# Altium schematic sheet COMPONENT BLOCKS 1.SchDoc
size A4; SheetNumber: 3; SheetTotal: 5
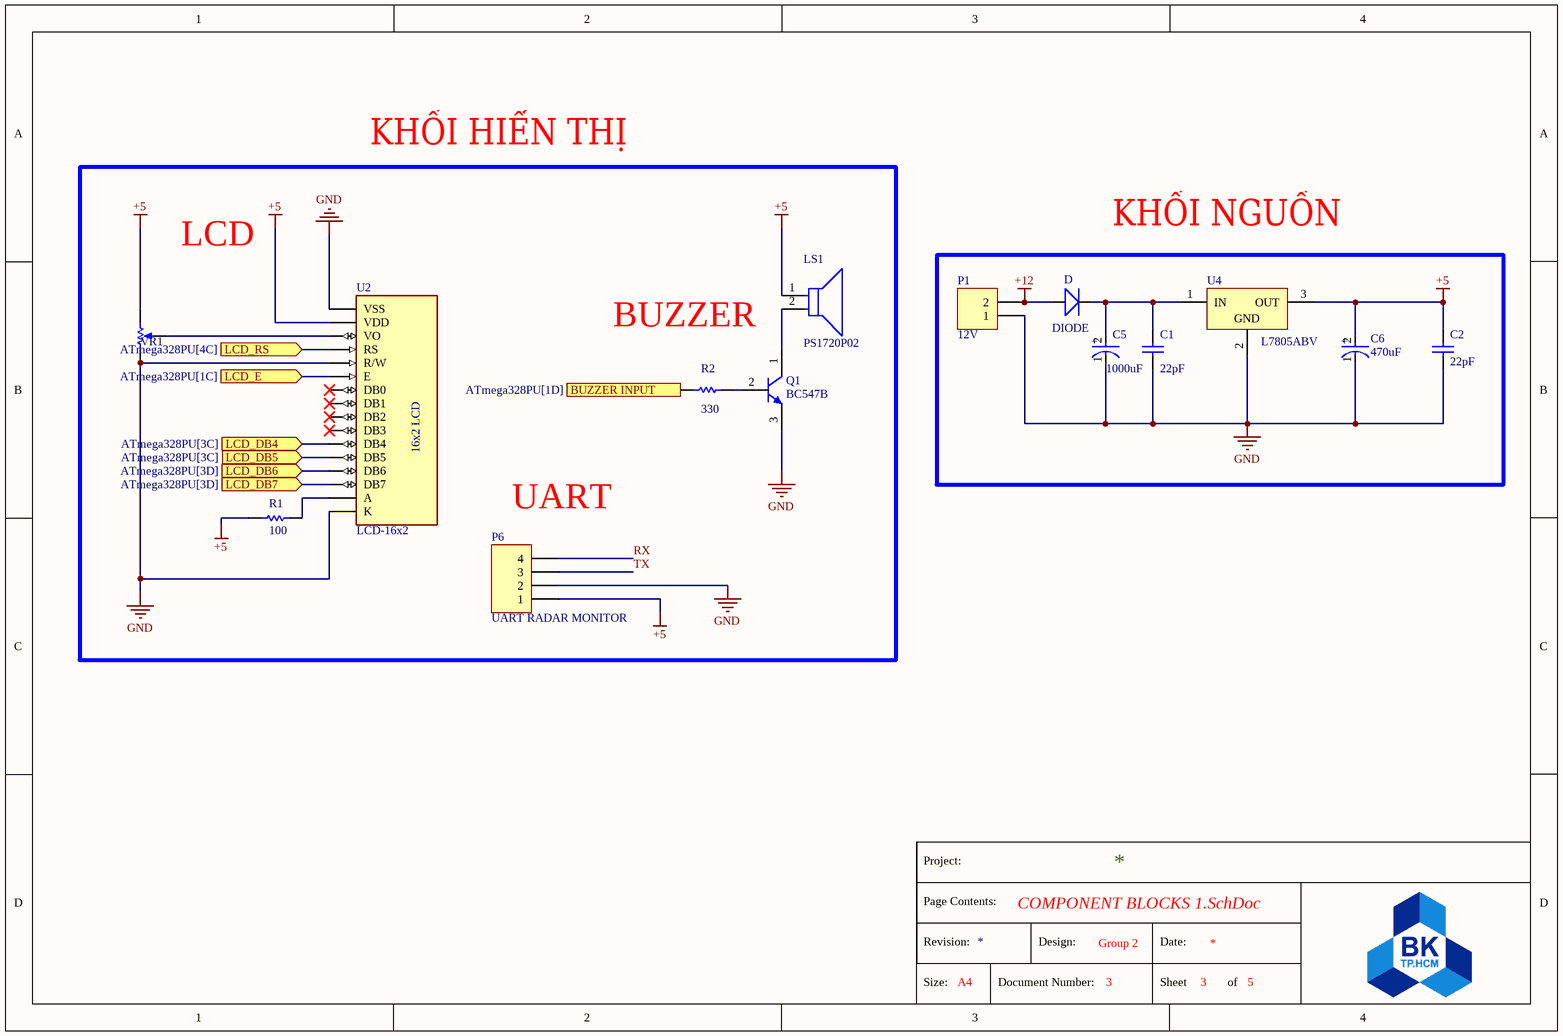
[diagram p0: COMPONENT BLOCKS 1.SchDoc]

## Parts
C1  value 22pF  [RAD-0.3]  (hidden comment: Cap)
C2  value 22pF  [RAD-0.3]  (hidden comment: Cap)
C5  1000uF  [FP-SMR-P45-MFG]
C6  470uF  [FP-SMR-P45-MFG]
D  DIODE  [DO-41]
LS1  PS1720P02  [FP-PS1720P02-MFG]
P1  12V  [HDR1X2]
P6  UART RADAR MONITOR  [HDR1X4]
Q1  BC547B  [ONSC-TO-92-3-29-11]
R1  value 100  [AXIAL-0.3]  (hidden comment: Res1)
R2  value 330  [AXIAL-0.3]  (hidden comment: Res1)
U2  LCD-16x2  [MODULE_LCD-16X2]
U4  L7805ABV  [TO220]
VR1  RPot  [VR5]  (value not drawn)

## Ports
BUZZER INPUT (in, see ATmega328PU[1D]), LCD_DB4 (in, see ATmega328PU[3C]), LCD_DB5 (in, see ATmega328PU[3C]), LCD_DB6 (in, see ATmega328PU[3D]), LCD_DB7 (in, see ATmega328PU[3D]), LCD_E (in, see ATmega328PU[1C]), LCD_RS (in, see ATmega328PU[4C])

## Nets
+5: C2.2 C6.2(A) LS1.1 P6.1 R1.1 U2.2(VDD) U4.3(OUT) VR1.2(BOT)
+12: D.1(POS) P1.2
GND: C1.1 C2.1 C5.1(C) C6.1(C) P1.1 P6.2 Q1.3(E) U2.1(VSS) U2.5(R/W) U2.16(K) U4.2(GND) VR1.1(TOP)
BUZZER INPUT: R2.1 ; port BUZZER INPUT
LCD_DB4: U2.11(DB4) ; port LCD_DB4
LCD_DB5: U2.12(DB5) ; port LCD_DB5
LCD_DB6: U2.13(DB6) ; port LCD_DB6
LCD_DB7: U2.14(DB7) ; port LCD_DB7
LCD_E: U2.6(E) ; port LCD_E
LCD_RS: U2.4(RS) ; port LCD_RS
RX: P6.4
TX: P6.3
NetC1_2: C1.2 C5.2(A) D.2(NEG) U4.1(IN)
NetLS1_2: LS1.2 Q1.1(C)
NetQ1_2: Q1.2(B) R2.2
NetR1_2: R1.2 U2.15(A)
NetU2_3: U2.3(VO) VR1.3(TAP)

Not connected (* = marked no-connect by the designer): U2 7(DB0)* 8(DB1)* 9(DB2)* 10(DB3)*

## Notes on the sheet
- KHỐI HIỂN THỊ
- LCD
- KHỐI NGUỒN
- BUZZER
- (near P6) UART
- Project:
- Page Contents:
- Revision:
- Size:
- A4
- Document Number:
- Design:
- Group 2
- Date:
- Sheet
- of
- (in symbol CMP-33768-000007-1) +
- (in symbol LCD-16X2) 16x2 LCD

## Library data of the parts
C1 C2 = Cap: Capacitor; Published: 8-Jun-2000; LatestRevisionDate: 17-Jul-2002; LatestRevisionNote: Re-released for DXP Platform.; PackageReference: RAD-0.3; Publisher: Altium Limited; PackageDescription: Radial Cap, Thru-Hole; 2 Leads; 0.3 in Pin Spacing
C5 = CMP-33768-000007-1: CAP ALUM 270UF 20% 450V SNAP; Ripple Current: 1.88A; Life (Hours): 2000Hour; Polarity: Polar; Case/Package: Radial; Height - Seated (Max): 1.87inch; Capacitance: 1000uF; Min Operating Temperature: -25°C; Package Quantity: 200; Packaging: Bulk; Lead Pitch: 0.394inch; Voltage Rating: 450V; Max Operating Temperature: 85°C; Mount: Through Hole; Tolerance: 20%
C6 = CMP-33768-000007-1: CAP ALUM 270UF 20% 450V SNAP; Ripple Current: 1.88A; Capacitance: 1000uF; Life (Hours): 2000Hour; Polarity: Polar; Case/Package: Radial; Height - Seated (Max): 1.87inch; Min Operating Temperature: -25°C; Package Quantity: 200; Packaging: Bulk; Lead Pitch: 0.394inch; Voltage Rating: 450V; Max Operating Temperature: 85°C; Mount: Through Hole; Tolerance: 20%
D = DIP-DIODE-50V-1A(DO-41): Diode Standard 50V 1A Through Hole DO-41; MF: Comchip Technology; MP: 1N4001-G; Package: DO-41 Comchip; Value: *; Price: None; SnapEDA_Link: https://www.snapeda.com/parts/1N4001-G/Comchip%20Technology/view-part/106354/?ref=snap; Availability: Unavailable
LS1 = CMP-08413-000001-1: AUDIO PIEZO TRANSDUCER 30V TH; Manufacturer: TDK Corporation; Frequency: 2kHz; Standoff Height: 0.5mm; RoHS: TRUE; ComponentLink2URL: https://product.tdk.com/info/en/catalog/datasheets/piezoelectronic_buzzer_ps_en.pdf; ComponentLink2Description: Datasheet; Lead Free: Yes; Temperature Range High: +70°C; Category: Speak; Height: 8.3mm; Device Class L1: Electromechanical; Device Class L3: Buzzers; Package: 0; Mouser Description: Audio Indicators & Alerts Round 17mmx8mm 2 kHz Vin=3V; Manufacturer Part Number: PS1720P02; Digikey Description: AUDIO PIEZO TRANSDUCER 30V TH; Device Class L2: Audio Products; Temperature Range Low: -10°C; Automotive: No; Octopart: https://octopart.com/ps1720p02-tdk-154429; Temperature: -10°C to +70°C
P1 = Header 2: Header, 2-Pin; LatestRevisionDate: 17-Jul-2002; LatestRevisionNote: Re-released for DXP Platform.; Publisher: Altium Limited
P6 = Header 4: Header, 4-Pin; LatestRevisionDate: 17-Jul-2002; LatestRevisionNote: Re-released for DXP Platform.; Publisher: Altium Limited
Q1 = CMP-1048-01467-1: Amplifier Transistor, NPN Silicon, 3-Pin TO-92, Bulk Box; Manufacturer: On Semiconductor; IC Continuous (A): 0.1; fT Min (MHz): 150; DatasheetVersion: Rev. 7; ComponentLink1URL: http://www.onsemi.com/; Polarity: NPN; RoHS: FALSE; ComponentLink1Description: Manufacturer URL; Packing: Bulk Box; PackageDescription: 3-Pin Transistor Outline, Body 4.825 x 3.685 mm, Pitch 1.27 mm; ComponentLink3URL: http://www.onsemi.cn/pub_link/Collateral/2N6426-D.PDF; ComponentLink2Description: Datasheet; PackageVersion: Rev. AM; PackageReference: TO-92-3-29-11_AM_SL; ComponentLink3Description: Package Specification; Mounting Technology: Through Hole; PartNumber: BC547B; ComponentLink2URL: http://www.onsemi.com/pub_link/Collateral/BC546-D.PDF
R1 R2 = Res1: Resistor; Published: 8-Jun-2000; LatestRevisionDate: 17-Jul-2002; LatestRevisionNote: Re-released for DXP Platform.; PackageReference: AXIAL-0.3; Publisher: Altium Limited; PackageDescription: Axial Device, Thru-Hole; 2 Leads; 0.3 in Pin Spacing
U2 = LCD-16X2: Display Development Tools 20x4 Black on Green Char LCD w Backlight; MF: Gravitech; SnapEDA_Link: https://www.snapeda.com/parts/LCD-16X2/Gravitech/view-part/?ref=snap; Package: None; Value: *; MP: LCD-16X2; Check_prices: https://www.snapeda.com/parts/LCD-16X2/Gravitech/view-part/?ref=eda
U4 = CMP-0244-00485-1: Positive Voltage Regulator, 5V, 3-Pin TO-220; ComponentLink1URL: http://www.st.com; PackageDescription: TO, Thru-Hole, Vertical, Heatsink Mounted; 3 In-Line Leads; Pitch 2.54 mm; DatasheetVersion: 16/11/2011; ComponentLink2Description: Datasheet; ComponentLink1Description: Manufacturer URL; PackageReference: TO220; ComponentLink3Description: Package Specification; ComponentLink2URL: http://www.st.com/internet/com/TECHNICAL_RESOURCES/TECHNICAL_LITERATURE/DATASHEET/CD00000444.pdf; ComponentLink3URL: http://www.st.com/internet/com/TECHNICAL_RESOURCES/TECHNICAL_LITERATURE/PACKAGE_INFORMATION/CD00004649.pdf; PackageVersion: ver3.0
VR1 = RPot: Potentiometer; Value: 10K; Sim Note: Enter the Resistance value and the set point into parameter fields.; Set Position: 0.5; Published: 8-Jun-2000; LatestRevisionDate: 17-Jul-2002; LatestRevisionNote: Re-released for DXP Platform.; PackageReference: VR5; Publisher: Altium Limited; PackageDescription: Variable Resistor, Thru-Hole; 3 Leads